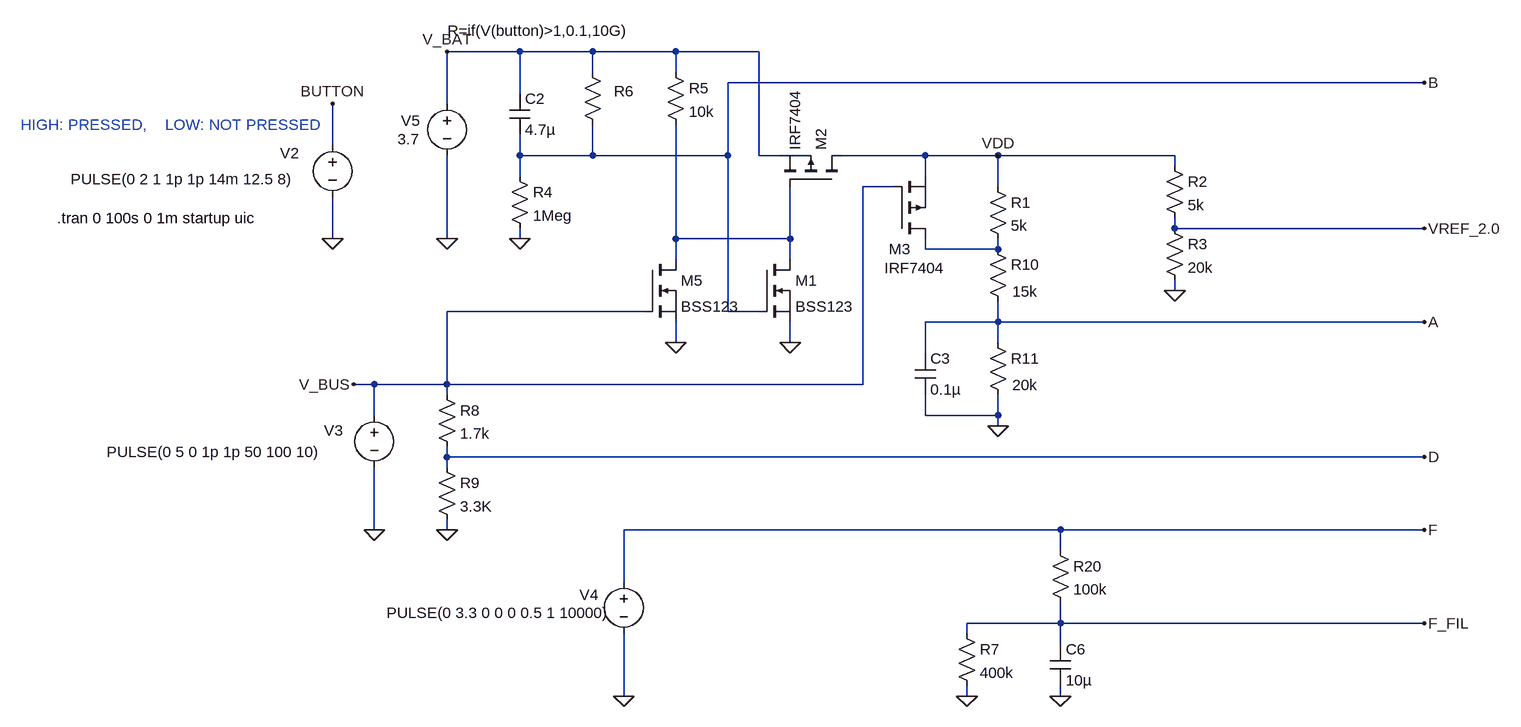
[diagram p0: schematic IndicatorOrg2.asc]
IndicatorOrg2.asc, the LTspice schematic file:
Version 4
SHEET 1 5544 3296
WIRE 1264 304 1152 304
WIRE 1376 304 1264 304
WIRE 1504 304 1376 304
WIRE 1632 304 1504 304
WIRE 1376 336 1376 304
WIRE 1504 336 1504 304
WIRE 2656 352 1584 352
WIRE 1264 368 1264 304
WIRE 1152 384 1152 304
WIRE 976 448 976 384
WIRE 1264 464 1264 432
WIRE 1376 464 1376 416
WIRE 1376 464 1264 464
WIRE 1584 464 1584 352
WIRE 1584 464 1376 464
WIRE 1632 464 1632 304
WIRE 1664 464 1632 464
WIRE 1888 464 1760 464
WIRE 2000 464 1888 464
WIRE 2272 464 2000 464
WIRE 2272 480 2272 464
WIRE 1264 496 1264 464
WIRE 1888 496 1888 464
WIRE 1840 512 1792 512
WIRE 2000 512 2000 464
WIRE 2272 576 2272 560
WIRE 2656 576 2272 576
WIRE 976 592 976 528
WIRE 1152 592 1152 464
WIRE 1264 592 1264 576
WIRE 1504 592 1504 416
WIRE 1680 592 1680 512
WIRE 1680 592 1504 592
WIRE 1888 608 1888 592
WIRE 2000 608 2000 592
WIRE 2000 608 1888 608
WIRE 1504 624 1504 592
WIRE 1680 624 1680 592
WIRE 2272 672 2272 656
WIRE 1456 704 1152 704
WIRE 1584 704 1584 464
WIRE 1632 704 1584 704
WIRE 2000 720 2000 688
WIRE 2000 720 1888 720
WIRE 2656 720 2000 720
WIRE 1504 752 1504 720
WIRE 1680 752 1680 720
WIRE 2000 752 2000 720
WIRE 1888 768 1888 720
WIRE 1040 816 1008 816
WIRE 1152 816 1152 704
WIRE 1152 816 1040 816
WIRE 1792 816 1792 512
WIRE 1792 816 1152 816
WIRE 1152 832 1152 816
WIRE 1040 864 1040 816
WIRE 1888 864 1888 832
WIRE 2000 864 2000 832
WIRE 2000 864 1888 864
WIRE 2000 880 2000 864
WIRE 1152 928 1152 912
WIRE 2656 928 1152 928
WIRE 1152 944 1152 928
WIRE 1040 1040 1040 944
WIRE 1152 1040 1152 1024
WIRE 2096 1040 1424 1040
WIRE 2656 1040 2096 1040
WIRE 2096 1072 2096 1040
WIRE 1424 1120 1424 1040
WIRE 2096 1184 2096 1152
WIRE 2096 1184 1952 1184
WIRE 2656 1184 2096 1184
WIRE 1952 1200 1952 1184
WIRE 2096 1216 2096 1184
WIRE 1424 1296 1424 1200
WIRE 1952 1296 1952 1280
WIRE 2096 1296 2096 1280
FLAG 1152 592 0
FLAG 976 592 0
FLAG 976 384 BUTTON
FLAG 1040 1040 0
FLAG 1008 816 V_BUS
FLAG 2656 928 D
FLAG 2656 720 A
FLAG 1424 1296 0
FLAG 2096 1296 0
FLAG 1152 304 V_BAT
FLAG 2656 1184 F_FIL
FLAG 1680 752 0
FLAG 1152 1040 0
FLAG 1264 592 0
FLAG 2000 880 0
FLAG 2000 464 VDD
FLAG 2272 672 0
FLAG 2656 576 VREF_2.0
FLAG 2656 352 B
FLAG 2656 1040 F
FLAG 1504 752 0
FLAG 1952 1296 0
SYMBOL cap 1248 368 R0
SYMATTR InstName C2
SYMATTR Value 4.7µ
SYMBOL res 1248 480 R0
SYMATTR InstName R4
SYMATTR Value 1Meg
SYMBOL res 1360 320 R0
WINDOW 3 -207 -48 Left 2
WINDOW 0 49 45 Left 2
SYMATTR Value R=if(V(button)>1,0.1,10G)
SYMATTR InstName R6
SYMBOL res 1984 592 R0
WINDOW 3 38 81 Left 2
SYMATTR Value 15k
SYMATTR InstName R10
SYMBOL res 1984 736 R0
WINDOW 3 38 81 Left 2
SYMATTR Value 20k
SYMATTR InstName R11
SYMBOL voltage 1152 368 R0
WINDOW 3 -76 71 Left 2
WINDOW 123 0 0 Left 0
WINDOW 39 0 0 Left 0
WINDOW 0 -71 42 Left 2
SYMATTR Value 3.7
SYMATTR InstName V5
SYMBOL voltage 976 432 R0
WINDOW 3 -59 68 Right 2
WINDOW 123 0 0 Left 0
WINDOW 39 0 0 Left 0
WINDOW 0 -81 28 Left 2
SYMATTR Value PULSE(0 2 1 1p 1p 14m 12.5 8)
SYMATTR InstName V2
SYMBOL voltage 1040 848 R0
WINDOW 3 -412 72 Left 2
WINDOW 123 0 0 Left 0
WINDOW 39 0 0 Left 0
WINDOW 0 -77 39 Left 2
SYMATTR Value PULSE(0 5 0 1p 1p 50 100 10)
SYMATTR InstName V3
SYMBOL voltage 1424 1104 R0
WINDOW 3 -365 64 Left 2
WINDOW 123 0 0 Left 0
WINDOW 39 0 0 Left 0
WINDOW 0 -68 36 Left 2
SYMATTR Value PULSE(0 3.3 0 0 0 0.5 1 10000)
SYMATTR InstName V4
SYMBOL res 2080 1056 R0
SYMATTR InstName R20
SYMATTR Value 100k
SYMBOL cap 2080 1216 R0
SYMATTR InstName C6
SYMATTR Value 10µ
SYMBOL pmos 1760 512 M270
SYMATTR InstName M2
SYMATTR Value IRF7404
SYMBOL res 1984 496 R0
SYMATTR InstName R1
SYMATTR Value 5k
SYMBOL nmos 1632 624 R0
SYMATTR InstName M1
SYMATTR Value BSS123
SYMBOL nmos 1456 624 R0
SYMATTR InstName M5
SYMATTR Value BSS123
SYMBOL res 1136 816 R0
SYMATTR InstName R8
SYMATTR Value 1.7k
SYMBOL res 1136 928 R0
SYMATTR InstName R9
SYMATTR Value 3.3K
SYMBOL cap 1872 768 R0
SYMATTR InstName C3
SYMATTR Value 0.1µ
SYMBOL res 2256 464 R0
SYMATTR InstName R2
SYMATTR Value 5k
SYMBOL res 2256 560 R0
SYMATTR InstName R3
SYMATTR Value 20k
SYMBOL res 1488 320 R0
SYMATTR InstName R5
SYMATTR Value 10k
SYMBOL pmos 1840 592 M180
WINDOW 0 -8 -16 Left 2
WINDOW 3 -15 -45 Left 2
SYMATTR InstName M3
SYMATTR Value IRF7404
SYMBOL res 1936 1184 R0
SYMATTR InstName R7
SYMATTR Value 400k
TEXT 552 560 Left 2 !.tran 0 100s 0 1m startup uic
TEXT 496 416 Left 2 ;HIGH: PRESSED,    LOW: NOT PRESSED

The netlist it stands for:
* IndicatorOrg2.asc
C2 V_BAT B 4.7µ
R4 B 0 1Meg
R6 V_BAT B R=if(V(button)>1,0.1,10G)
R10 N002 A 15k
R11 A 0 20k
V5 V_BAT 0 3.7
V2 BUTTON 0 PULSE(0 2 1 1p 1p 14m 12.5 8)
V3 V_BUS 0 PULSE(0 5 0 1p 1p 50 100 10)
V4 F 0 PULSE(0 3.3 0 0 0 0.5 1 10000)
R20 F F_FIL 100k
C6 F_FIL 0 10µ
M2 VDD N001 V_BAT V_BAT IRF7404
R1 VDD N002 5k
M1 N001 B 0 0 BSS123
M5 N001 V_BUS 0 0 BSS123
R8 V_BUS D 1.7k
R9 D 0 3.3K
C3 A 0 0.1µ
R2 VDD VREF_2.0 5k
R3 VREF_2.0 0 20k
R5 V_BAT N001 10k
M3 N002 V_BUS VDD VDD IRF7404
R7 F_FIL 0 400k
.model NMOS NMOS
.model PMOS PMOS
.lib standard.mos
.tran 0 100s 0 1m startup uic
* HIGH: PRESSED,    LOW: NOT PRESSED
.backanno
.end